# Altium schematic sheet Принципиальная схема Peggy Tracker.SchDoc
size 420 x 297 mm; ENG_APP_DATE: --/--/--; DSN_APP_DATE: --/--/--; CHK_APP_DATE: --/--/--; Scale: 1:1; Разраб.: Иванов; Обозначение документа: АБВГ.123456.001 Э3; Пров.: Петров; Утв.: Сидоров; Наименование организации: ОАО "Ваша фирма"; Перв. применение: АБВГ.123456.000; Наименование изделия 1: Плата; Наименование изделия 2: Схема электрическая; Наименование изделия 3: принципиальная; Нач. отд.: Нач. отд.; Фамилия нач. отд.: Сидоров
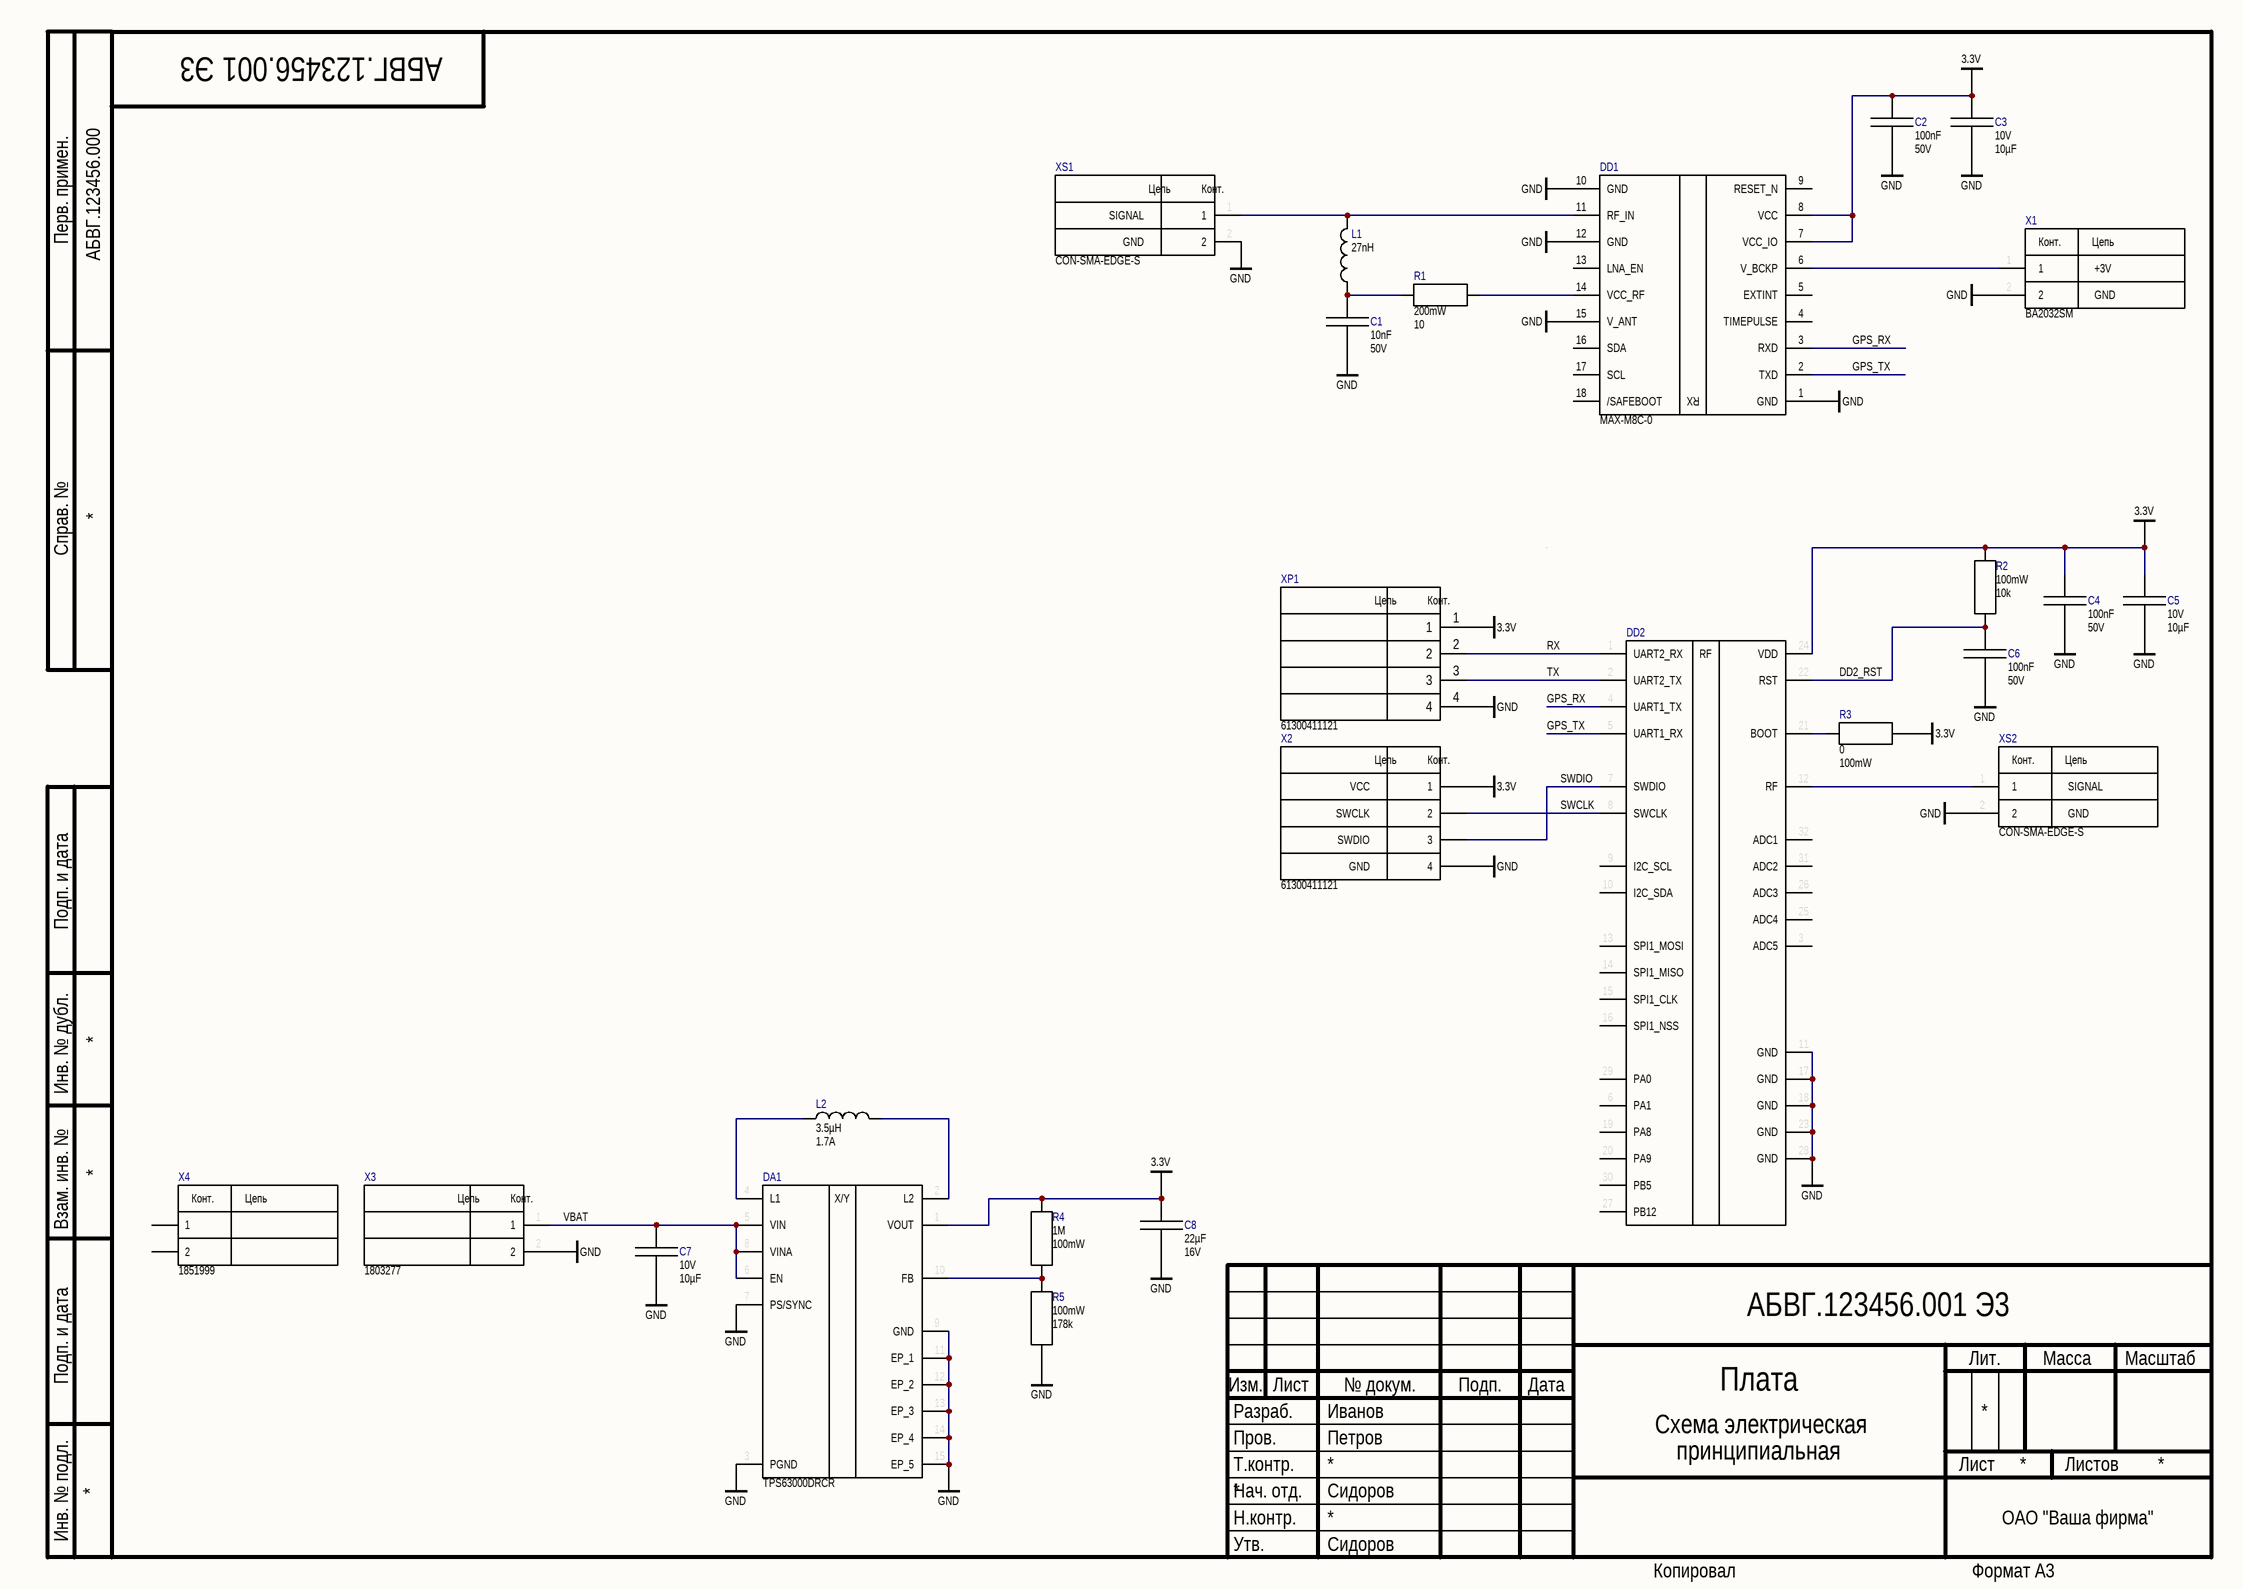
[diagram p0: Принципиальная схема Peggy Tracker.SchDoc]

## Parts
C1  value 10nF  Voltage Rating: 50V  [CAPC1608X09N]  (hidden comment: GCM188R71H103KA37D)
C2  value 100nF  Voltage Rating: 50V  [CAPC1608X09N]  (hidden comment: GCM188R71H104KA57D)
C3  Voltage Rating: 10V  Capacitance: 10µF  [CAPC2013X135X45NL10T25]  (hidden comment: CL21Y106KPQVPNE)
C4  value 100nF  Voltage Rating: 50V  [CAPC1608X09N]  (hidden comment: GCM188R71H104KA57D)
C5  Voltage Rating: 10V  Capacitance: 10µF  [CAPC2013X135X45NL10T25]  (hidden comment: CL21Y106KPQVPNE)
C6  value 100nF  Voltage Rating: 50V  [CAPC1608X09N]  (hidden comment: GCM188R71H104KA57D)
C7  Voltage Rating: 10V  Capacitance: 10µF  [CAPC2013X135X45NL10T25]  (hidden comment: CL21Y106KPQVPNE)
C8  value 22µF  Voltage Rating: 16V  [CAPC2013X140X45NL15T25]  (hidden comment: C2012X5R1C226K125AC)
DA1  Manufacturer Part Number: TPS63000DRCR  [TPS63002DRCR]  (hidden comment: TPS63000IDRCRQ1)
DD1  MAX-M8C-0  [MAXM8C0]
DD2  RAK3172(H)  [RAK3172(H)-Footprint-1]  (value not drawn)
L1  value 27nH  [INDC1005X55X25ML5T10]  (hidden comment: LQW15AN27NG00D)
L2  value 3.5µH  Saturation Current: 1.7A  [SRU5018680Y]  (hidden comment: SRU5018-3R5Y)
R1  value 10  Power Rating: 200mW  [RESC1608X95X40LL15T20]  (hidden comment: SG73P1JTTD100J)
R2  Power Rating: 100mW  Resistance: 10k  [RESC1608X55X25LL10T15]  (hidden comment: RMCF0603FT10K0)
R3  value 0  Power Rating: 100mW  [RESC1608X55X25LL10T15]  (hidden comment: RMCF0603ZT0R00)
R4  value 1M  Power Rating: 100mW  [RESC1608X95X40LL15T20]  (hidden comment: RMCF0603JT1M00)
R5  value 178k  Power Rating: 100mW  [RESC1608X95X40LL15T20]  (hidden comment: ERJ-3EKF1783V)
X1  BA2032SM  [MPD-BA2032SM_V]
X2  Manufacturer Part Number: 61300411121  [20021311-00010T4LF-Footprint-1]  (hidden comment: ST-LINK-SWD-CONNECTOR)
X3  1803277  [PHOE-1803277_V]
X4  1851999
XP1  61300411121  [20021311-00010T4LF-Footprint-1]
XS1  CON-SMA-EDGE-S  [RFSOLUTIONS_CON-SMA-EDGE-S]
XS2  CON-SMA-EDGE-S  [RFSOLUTIONS_CON-SMA-EDGE-S]

## Nets
3.3V: C2.1 C3.2 C4.2 C5.2 C8.2 DA1.1(VOUT) DD1.7(VCC_IO) DD1.8(VCC) DD2.24(VDD) R2.2 R3.2 R4.2 X2.1(VCC) XP1.1
GND: C1.2 C2.2 C3.1 C4.1 C5.1 C6.1 C7.1 C8.1 DA1.3(PGND) DA1.7(PS/SYNC) DA1.9(GND) DA1.11(EP_1) DA1.12(EP_2) DA1.13(EP_3) DA1.14(EP_4) DA1.15(EP_5) DD1.1(GND) DD1.10(GND) DD1.12(GND) DD1.15(V_ANT) DD2.11(GND) DD2.17(GND) DD2.18(GND) DD2.23(GND) DD2.28(GND) R5.1 X1.2(GND) X2.4(GND) X3.2 XP1.4 XS1.2(GND) XS2.2(GND)
DD2_RST: C6.2 DD2.22(RST) R2.1
GPS_RX: DD1.3(RXD) DD2.4(UART1_TX)
GPS_TX: DD1.2(TXD) DD2.5(UART1_RX)
RX: DD2.1(UART2_RX) XP1.2
SWCLK: DD2.8(SWCLK) X2.2(SWCLK)
SWDIO: DD2.7(SWDIO) X2.3(SWDIO)
TX: DD2.2(UART2_TX) XP1.3
VBAT: C7.2 DA1.5(VIN) DA1.6(EN) DA1.8(VINA) X3.1
NetC1_1: C1.1 L1.1 R1.1
NetDA1_2: DA1.2(L2) L2.2
NetDA1_4: DA1.4(L1) L2.1
NetDA1_10: DA1.10(FB) R4.1 R5.2
NetDD1_6: DD1.6(V_BCKP) X1.1(+3V)
NetDD1_11: DD1.11(RF_IN) L1.2 XS1.1(SIGNAL)
NetDD1_14: DD1.14(VCC_RF) R1.2
NetDD2_12: DD2.12(RF) XS2.1(SIGNAL)
NetDD2_21: DD2.21(BOOT) R3.1

Not connected (* = marked no-connect by the designer): DD1 4(TIMEPULSE) 5(EXTINT) 9(RESET_N) 13(LNA_EN) 16(SDA) 17(SCL) 18(/SAFEBOOT); DD2 3(ADC5) 6(PA1) 9(I2C_SCL) 10(I2C_SDA) 13(SPI1_MOSI) 14(SPI1_MISO) 15(SPI1_CLK) 16(SPI1_NSS) 19(PA8) 20(PA9) 25(ADC4) 26(ADC3) 27(PB12) 29(PA0) 30(PB5) 31(ADC2) 32(ADC1); X4 1 2

## Notes on the sheet
- Перв. примен.
- Справ. №
- Подп. и дата
- Инв. № дубл.
- Взам. инв. №
- Разраб.
- Изм.
- Лист
- № докум.
- Подп.
- Дата
- Лит.
- Масса
- Масштаб
- Пров.
- Т.контр.
- Листов
- Инв. № подл.
- Утв.
- Н.контр.
- Копировал
- Формат А3
- (in symbol CMP-002-00003-10) Конт.; Цепь
- (in symbol CMP-002-00014-7) Цепь; Конт.
- (in symbol CMP-002-00086-2) Цепь; Конт.
- (in symbol CMP-002-00091-3) Цепь; Конт.
- (in symbol CMP-002-00092-3) Цепь; Конт.
- (in symbol CMP-002-00106-1) Конт.; Цепь
- (in symbol CMP-021-00007-2) RX
- (in symbol CMP-031-00015-3) X/Y

## Library data of the parts
C1 = CMP-001-00124-4: CAP CER 10000PF 50V X7R 0603; Manufacturer: Murata; Lybrary Path: Capacitors.SchLib; Tolerance: 10%; ComponentLink5Description: https://datasheet.ciiva.com/132/product-132007.pdf?src-supplier=Digi-Key; Lead Free: Lead Free; ComponentLink3Description: https://datasheet.ciiva.com/11789/0900766b80ef92d0-11789046.pdf?src-supplier=RSComponents; Stock 1: 4826468; Width: 0.031inch; RoHS: Yes; Radiation Hardening: No; Case/Package: 0603; Voltage: 50V; ComponentLink4URL: https://datasheet.ciiva.com/18183/getdatasheetpartid-178897-18183622.pdf?src-supplier=Verical; ComponentLink1Description: https://datasheet.ciiva.com/16624/product-16624561.pdf?src-supplier=Avnet+Europe; Pricing 1: 1=0,17000, 10=0,11900, 50=0,06740, 100=0,05580, 500=0,03912, 1000=0,03239 (USD); Mount: Surface Mount; ComponentLink6Description: https://datasheet.ciiva.com/16213/s0717e-16213899.pdf?src-supplier=Future+Electronics; ComponentLink4Description: https://datasheet.ciiva.com/18183/getdatasheetpartid-178897-18183622.pdf?src-supplier=Verical; ComponentLink1URL: https://datasheet.ciiva.com/16624/product-16624561.pdf?src-supplier=Avnet+Europe; ComponentLink3URL: https://datasheet.ciiva.com/11789/0900766b80ef92d0-11789046.pdf?src-supplier=RSComponents; ComponentLink6URL: https://datasheet.ciiva.com/16213/s0717e-16213899.pdf?src-supplier=Future+Electronics; Depth: 0.8mm; RoHS Compliant: Yes; Case Code (Metric): 1608; ComponentLink2Description: https://datasheet.ciiva.com/132/product-132006.pdf?src-supplier=Digi-Key; Height: 0.8mm; Length: 1.6mm; Packaging: Tape and Reel; REACH SVHC: No SVHC; Thickness: 0.035inch; Dielectric: X7R; Package Quantity: 1; Min Operating Temperature: -55°C; Ratings: AEC-Q200; Voltage Rating (DC): 50V; Construction: Flat; ComponentLink5URL: https://datasheet.ciiva.com/132/product-132007.pdf?src-supplier=Digi-Key; Max Operating Temperature: 125°C; ComponentLink2URL: https://datasheet.ciiva.com/132/product-132006.pdf?src-supplier=Digi-Key; Manufacturer Part Number: GCM188R71H103KA37D; Source: Meteo_1.SCHLIB; Design Item ID: 1_7; Termination: SMD/SMT; Series: GCM
C2 C4 C6 = CMP-001-00128-5: CAP CER 0.1UF 50V X7R 0603; Manufacturer: Murata; Tolerance: 10%; Approvals: CSA,UR; Color: Grey; RoHS Compliant: Yes; Case/Package: 0603; Max Operating Temperature: 125°C; Min Operating Temperature: -55°C; Case Code (Metric): 1608; Depth: 0.8mm; Dielectric: X7R; Height: 0.8mm; Length: 1.6mm; Mount: Surface Mount; Package Quantity: 1; Packaging: Tape and Reel; Radiation Hardening: No; Series: GCM; Termination: SMD/SMT; Thickness: 0.035inch; Width: 0.031inch; Manufacturer Part Number: GCM188R71H104KA57D; Lead Free: Lead Free; REACH SVHC: No SVHC; Voltage: 50V; ComponentLink1Description: https://datasheet.ciiva.com/16624/product-16624562.pdf?src-supplier=Avnet+Europe; ComponentLink1URL: https://datasheet.ciiva.com/16624/product-16624562.pdf?src-supplier=Avnet+Europe; ComponentLink2Description: https://datasheet.ciiva.com/133/product-133574.pdf?src-supplier=Digi-Key; ComponentLink2URL: https://datasheet.ciiva.com/133/product-133574.pdf?src-supplier=Digi-Key; ComponentLink3Description: https://datasheet.ciiva.com/133/product-133575.pdf?src-supplier=Digi-Key; ComponentLink3URL: https://datasheet.ciiva.com/133/product-133575.pdf?src-supplier=Digi-Key; ComponentLink4Description: https://datasheet.ciiva.com/18183/getdatasheetpartid-98693-18183626.pdf?src-supplier=Verical; ComponentLink4URL: https://datasheet.ciiva.com/18183/getdatasheetpartid-98693-18183626.pdf?src-supplier=Verical; ComponentLink5Description: https://datasheet.ciiva.com/11786/0900766b80ef92d0-11786863.pdf?src-supplier=RSComponents; ComponentLink5URL: https://datasheet.ciiva.com/11786/0900766b80ef92d0-11786863.pdf?src-supplier=RSComponents; ComponentLink6Description: https://datasheet.ciiva.com/133/product-133573.pdf?src-supplier=Digi-Key; ComponentLink6URL: https://datasheet.ciiva.com/133/product-133573.pdf?src-supplier=Digi-Key; ComponentLink7Description: https://datasheet.ciiva.com/2989/product-2989242.pdf?src-supplier=Avnet; ComponentLink7URL: https://datasheet.ciiva.com/2989/product-2989242.pdf?src-supplier=Avnet; ComponentLink8Description: https://datasheet.ciiva.com/16497/product-16497247.pdf?src-supplier=Future+Electronics; ComponentLink8URL: https://datasheet.ciiva.com/16497/product-16497247.pdf?src-supplier=Future+Electronics; Construction: Flat; Design Item ID: 1_16; Pricing 1: 1=0,11000, 10=0,07900, 50=0,04280, 100=0,03500, 500=0,02502, 1000=0,01966 (USD); Ratings: AEC-Q200; RoHS: Yes; Source: Meteo_1.SCHLIB; Stock 1: 4755830; Voltage Rating (DC): 50V
C3 C5 C7 = CMP-001-00143-4: CAP CER 10UF 10V X7S 0805; Manufacturer: Samsung; Value: 10µF; Tolerance: 10%; Manufacturer Part Number: CL21Y106KPQVPNE; Packaging: Tape and Reel; Max Operating Temperature: 125°C; RoHS Compliant: Yes; Case/Package: 0805; Features: Soft Termination; Case Code (Imperial): 0805; Thickness: 0.055inch; Length: 0.079inch; Min Operating Temperature: -55°C; Width: 0.049inch; Ratings: AEC-Q200; Mount: Surface Mount; Case Code (Metric): 2012; Lead Free: Lead Free
C8 = CMP-001-00144-1: TDK - C2012X5R1C226K125AC - SMD Multilayer Ceramic Capacitor, 22 µF, 16 V, 0805 [2012 Metric], ± 10%, X5R, C Series; Capacitance: 22uF; Case/Package: 0805; RoHS Compliant: Yes; Min Operating Temperature: -55°C; Tolerance: 10%; Max Operating Temperature: 85°C; Manufacturer Part Number: C2012X5R1C226K125AC; Series: C; Thickness: 0.057inch; Manufacturer: TDK; Case Code (Imperial): 0805; Mount: Surface Mount; Case Code (Metric): 2012; Termination: Wraparound; Packaging: Tape and Reel; Width: 0.049inch; Length: 2mm; Dielectric: X5R; Construction: Flat; Depth: 1.25mm; Package Quantity: 1; Dielectric Material: Ceramic; Height: 1.25mm; Lead Free: Lead Free; Number of Pins: 2; REACH SVHC: No SVHC; Resistor Type: Ceramic; Voltage: 16V; Voltage Rating (DC): 16V; Weight: 0.000194oz
DA1 = CMP-031-00015-3: IC REG BUCK BOOST ADJ 1.6A 10SON; Manufacturer: Texas Instruments; Max Input Voltage: 5.5V; Topology: Buck-Boost; Min Output Voltage: 1.2V; Quiescent Current: 40uA; Output Type: Adjustable; Number of Outputs: 1; Synchronous Rectifier: Yes; Max Output Current: 1.2A; Min Input Voltage: 1.8V; Output Configuration: Positive; Efficiency: 96%; Switching Frequency: 1.5MHz; Min Operating Temperature: -40°C; Output Current: 1.6A; Max Output Voltage: 5.5V; Output Voltage: 5.5V; Weight: 0.000921oz; Series: Automotive, AEC-Q100; Max Operating Temperature: 85°C; Contact Plating: Gold; Number of Pins: 10; Width: 3mm; Operating Supply Voltage: 5.5V; Packaging: Tape and Reel; RoHS Compliant: Yes; Package Quantity: 1; Lead Free: Lead Free; Case/Package: VSON
DD1 = CMP-021-00007-2: IC Receiver Gps/gnss 18LCC; Manufacturer: u-blox; Manufacturer Part Number: MAX-M8C-0; RoHS Compliant: Yes
DD2 = CMP-00025-00003-1: RAK3172 WisDuo LPWAN Module; Manufacturer: RAK Wireless; Manufacturer Part Number: RAK3172(H)
L1 = CMP-006-00036-2: INDUCTOR; Manufacturer: Murata; Max DC Current: 280mA; Inductance Tolerance: 2%; Q Factor: 25; Test Frequency: 100MHz; Core Material: Air,Ferrite; Shielding: Unshielded; Current: 260mA; DC Resistance (DCR): 520mR; Self Resonant Frequency: 3.5GHz; Case Code (Imperial): 0402; Radiation Hardening: No; Tolerance: 2%; Package Quantity: 1; Width: 0.5mm; Length: 1mm; Weight: 2.8E-05oz; Number of Pins: 2; Height: 0.5mm; Inductance: 27nH; Case/Package: 0402; REACH SVHC: No SVHC; Military Standard: Not; Current Rating: 280mA; Mount: Surface Mount; Max Operating Temperature: 125°C; Depth: 0.6mm; Packaging: Tape and Reel; Termination: SMD/SMT; RoHS Compliant: Yes; Min Operating Temperature: -55°C; Lead Free: Lead Free; Case Code (Metric): 1005; DC Current: 280mA; Manufacturer Part Number: LQW15AN27NG00D
L2 = CMP-006-00039-2: Ind Power Shielded Wirewound 3.5uH 30% 100KHz 9Q-Factor Ferrite 2.1A T/R; Manufacturer: Bourns; Self Resonant Frequency: 90MHz; Q Factor: 9; DC Resistance (DCR): 32mR; DC Current: 2.1A; Height: 1.8mm; Packaging: Tape and Reel; Tolerance: 30%; Series: SRU5018; Core Material: Ferrite; Inductance: 3.5uH; Current Rating: 2.1A; Length: 5.2mm; Termination: SMD/SMT; Test Frequency: 100kHz; Shielding: Shielded; Number of Pins: 2; RoHS Compliant: Yes; Case/Package: 5018; Max DC Current: 2.1A; Military Standard: Not; Min Operating Temperature: -40°C; Mount: Surface Mount; Width: 0.205inch; Package Quantity: 1000; Max Operating Temperature: 125°C; Depth: 5.4mm; Manufacturer Part Number: SRU5018-3R5Y
R1 = CMP-00014-1: Thick Film Resistors - SMD 0.2W 10ohm 5% 100ppm Anti-Pulse; Voltage Rating (DC): 50V; Component Comment: 10 200mW; Temperature Coefficient: 100ppm/°C; Max Operating Temperature: 155°C; Resistor Type: Thick Film; Length: 1.6mm; Series: SG73; Tolerance: 5%; Height: 0.45mm; Packaging: Tape and Reel; Width: 0.8mm; RoHS Compliant: Yes; Resistance: 10; Weight: 7.1E-05oz; Case Code (Imperial): 0603; Case/Package: 0603; Min Operating Temperature: -55°C; Case Code (Metric): 1608; Voltage Rating: 50V; Termination: SMD/SMT
R2 = CMP-009-00252-4: RES SMD 10K OHM 1% 1/10W 0603; Manufacturer: Stackpole Electronics Inc; Temperature Coefficient: 100ppm/°C; Voltage Rating: 75V; Component Comment: 10k 100mW; Features: Automotive AEC-Q200; Lead Free: Lead Free; Case/Package: 0603; Min Operating Temperature: -55°C; Max Power Dissipation: 100mW; Case Code (Metric): 1608; Contact Plating: Tin,Matte; Number of Terminations: 2; Military Standard: Not; Size Code: 0603; Manufacturer Part Number: RMCF0603FT10K0; Pins: 2; Width: 0.031inch; Radiation Hardening: No; Mount: Surface Mount; Case Code (Imperial): 0603; Depth: 0.8mm; Max Operating Temperature: 155°C; Height: 0.022inch; Tolerance: 1%; Resistor Type: Thick Film; RoHS Compliant: Yes; Packaging: Tape and Reel; Construction: Rectangular; Series: RMCF; Length: 1.55mm
R3 = CMP-009-00251-4: Res Thkflm 0603 0 Ohm Jumper 1/10W 100Ppm/ C Smd Rohs Compliant: Yes; Manufacturer: Stackpole Electronics Inc; Current Rating: 1A; Working Voltage: 75V; Component Comment: 0 100mW; Min Operating Temperature: -55°C; Length: 1.55mm; Resistance: 0; Mount: Surface Mount; Max Operating Temperature: 155°C; Height: 0.022inch; RoHS Compliant: Yes; Radiation Hardening: No; Case Code (Metric): 1608; Contact Plating: Tin,Matte; Width: 0.031inch; Resistor Type: Thick Film; Construction: Rectangular; Military Standard: Not; Lead Free: Lead Free; Depth: 0.8mm; Case Code (Imperial): 0603; Number of Terminations: 2; Series: RMCF; Max Power Dissipation: 100mW; Packaging: Tape and Reel; Features: Automotive AEC-Q200; Case/Package: 0603; Manufacturer Part Number: RMCF0603ZT0R00
R4 = CMP-00024-2: RES 1M OHM 5% 1/10W 0603; Manufacturer: Stackpole Electronics; Working Voltage: 75V; Component Comment: 1M 100mW; Temperature Coefficient: 200ppm/°C; Radiation Hardening: No; Width: 0.031inch; Tolerance: 5%; Case Code (Metric): 1608; Mount: Surface Mount; Number of Terminations: 2; Construction: Rectangular; Military Standard: Not; Resistor Type: Thick Film; Height: 0.022inch; Max Power Dissipation: 100mW; Series: RMCF; Contact Plating: Tin,Matte; Case Code (Imperial): 0603; Max Operating Temperature: 155°C; Resistance: 1M; Depth: 0.8mm; Lead Free: Lead Free; Min Operating Temperature: -55°C; Length: 1.55mm; Technology: THICK FILM; Case/Package: 0603; Features: Automotive AEC-Q200; Packaging: Tape and Reel; RoHS Compliant: Yes; Manufacturer Part Number: RMCF0603JT1M00
R5 = CMP-00025-2: ICK FILM, RESISTOR, 178KOHM, 100mW, ±1%; Product Range:PANASONIC - ERJ Series; Resistance:178kohm; Power Rating:100mW; Resistance Tolerance:± 1%; Resistor Case Style:0603 ^1608 Metric]; Resistor Element Type:Thick Film; MSL:-; Voltage Rating (DC): 50V; Component Comment: 178k 100mW; Temperature Coefficient: 100ppm/°C; Voltage Rating: 75V; Resistance: 178k; Depth: 0.8mm; Width: 0.8mm; Construction: Rectangular; Lead Free: Lead Free; REACH SVHC: No SVHC; Termination: SMD/SMT; Series: ERJ; Number of Terminations: 2; Case Code (Metric): 1608; Technology: THICK FILM; Resistance Tolerance: 1%; Military Standard: Not; Min Operating Temperature: -55°C; Max Operating Temperature: 155°C; Case/Package: 0603; Features: Automotive AEC-Q200; Length: 1.6mm; Package Quantity: 1; Case Code (Imperial): 0603; Tolerance: 1%; Packaging: Tape and Reel; Resistor Type: Thick Film; Max Power Dissipation: 100mW; Contact Plating: Tin; Mount: Surface Mount; Height: 0.45mm; RoHS Compliant: Yes; Manufacturer Part Number: ERJ-3EKF1783V; Manufacturer: Panasonic
X1 = CMP-002-00003-10: Battery Holder Coin 20MM SMD; Manufacturer: Memory Protection Devices; Number of Cells: 1; Mounting Technology: SM; RoHS Compliant: True; Pins: 2; Connector Type: BatteryHolder; Manufacturer Part Number: BA2032SM; Package Quantity: 100; Max Operating Temperature: 225°C; Min Operating Temperature: -40°C; Case/Package: BA2032SM; Diameter: 20mm; Mount: Surface Mount,PCB; Lead Free: Lead Free; Termination: SMD/SMT; Series: -
X2 = CMP-002-00091-3: Conn Unshrouded Header HDR 4 POS 2.54mm Solder ST Thru-Hole Bag; Manufacturer: Würth Elektronik; Position: 4; Pitch: 0.1inch; Connector Type: Male Pin; Gender: Male; Number of Rows: 1; Color: Black; REACH SVHC: Unknown; Contact Material: Copper; Mount: Through Hole; Contact Plating: Gold; Contact Mating Length: 0.236inch; Number of Contacts: 4; Lead Free: Lead Free; Number of Positions: 4; RoHS Compliant: Yes; Pins: 4; Packaging: Bulk; Termination: Solder
X3 = CMP-002-00014-7: Male Header, Pitch 3.81 mm, 1 x 2 Position, Height 7.25 mm, Tail Length 3.4 mm, RoHS, Bulk; Manufacturer: Phoenix Contact; Rows: 1; Voltage Rating: 160V; Current Rating: 8A; Mounting Technology: TH; Contact Plating: Tin; Datasheet Version: Feb-14; Gender: Male; Connector Type: Header; Pins: 2; RoHS Compliant: True; Case/Package: 1803277; Package Description: Male Header, Pitch 3.81 mm, 1 x 2 Position, Height 7.25 mm, Tail Length 3.4 mm; Manufacturer Part Number: 1803277; Datasheet URL: https://datasheet.ciiva.com/16096/1803277-16096845.pdf; Diameter: 7.25mm; Package Quantity: 50; Packaging: Bulk; Lead Pitch: 0.15inch; Colour: Green; Package Reference: 1803277
X4 = CMP-002-00106-1: Pluggable Terminal Blocks 2 Pos 3.81mm pitch Plug 28-16 AWG Screw; Manufacturer: Phoenix Contact; Number of Contacts: 2; Wire Gauge (Min): 14AWG; Gender: Female; Voltage Rating: 160V; Current: 8A; Wire Gauge (Max): 30AWG; Number of Levels: 1; Voltage: 300V; Color: Green; Number of Rows: 1; Number of Positions: 2; Manufacturer Part Number: 1851999; Pitch: 3.81mm; Housing Color: Green; Height: 11.1mm; Number of Circuits: 2; Mount: Free Hanging,Cable; Packaging: Bulk; Pins: 2; Series: COMBICON MC; Termination: Screw; Number of Positions Per Level: 2; Contact Material: Gold; Package Quantity: 50; Length: 3.81mm; Housing Material: Plastic; Connector Type: Screw; Orientation: Straight; Contact Plating: Gold; Depth: 11.1mm; Material: Polyamide; Width: 16.1mm; Current Rating: 8A; Flammability Rating: UL94 V-0; Max Current Rating: 8A; Weight: 0.053969oz
XP1 = CMP-002-00092-3: Conn Unshrouded Header HDR 4 POS 2.54mm Solder ST Thru-Hole Bag; Manufacturer: Würth Elektronik; Position: 4; Connector Type: Male Pin; Gender: Male; Pitch: 0.1inch; Number of Rows: 1; Number of Positions: 4; Contact Mating Length: 0.236inch; Color: Black; Contact Material: Copper; Lead Free: Lead Free; RoHS Compliant: Yes; Packaging: Bulk; Mount: Through Hole; Number of Contacts: 4; REACH SVHC: Unknown; Contact Plating: Gold; Termination: Solder; Pins: 4; Manufacturer Part Number: 61300411121
XS1 XS2 = CMP-002-00086-2: CONN SMA JACK STR EDGE MNT; Manufacturer: RF Solutions; Connector Type: SMA,Socket; Number of Ports: 1; Termination: Solder; Pins: 3; Package Quantity: 1; Mount: Edge; Case/Package: SMA; Manufacturer Part Number: CON-SMA-EDGE-S; Fastening Type: Threaded